# Altium schematic sheet pulsewidth2.SchDoc
size A4; SheetNumber: 2; SheetTotal: 4
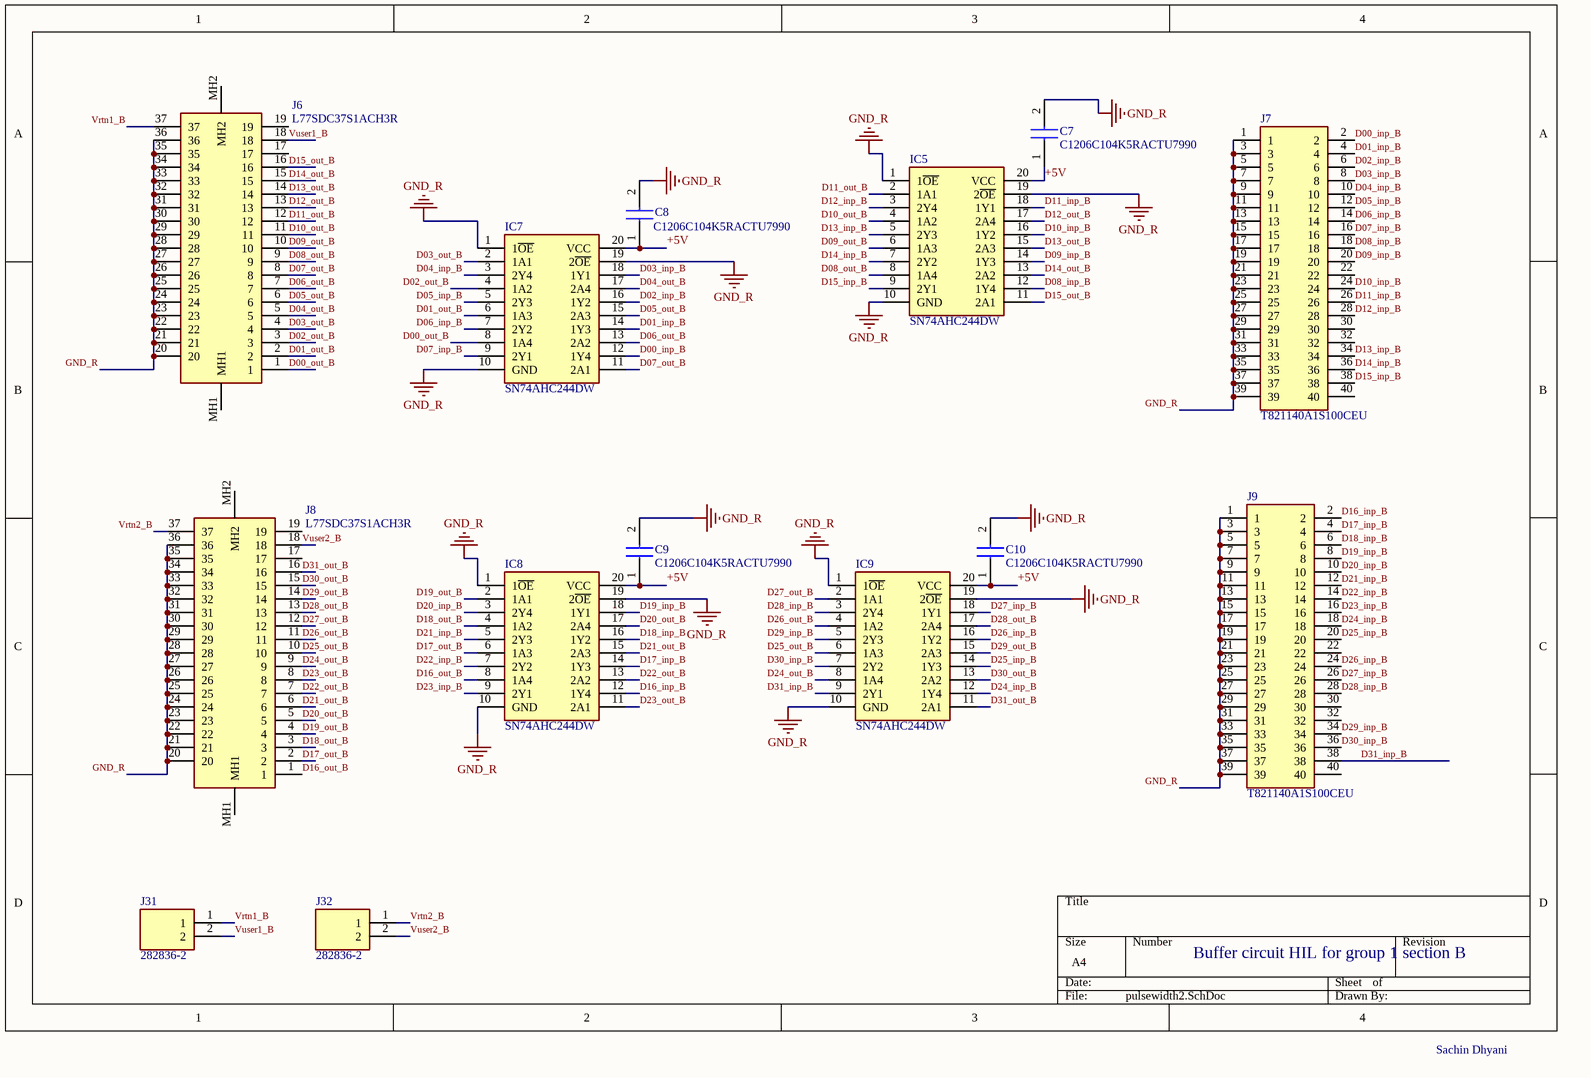
[diagram p0: pulsewidth2.SchDoc]

## Parts
C7  C1206C104K5RACTU7990  [CAPC3216X88N]
C8  C1206C104K5RACTU7990  [CAPC3216X88N]
C9  C1206C104K5RACTU7990  [CAPC3216X88N]
C10  C1206C104K5RACTU7990  [CAPC3216X88N]
IC5  SN74AHC244DW  [SOIC127P1030X265-20N]
IC7  SN74AHC244DW  [SOIC127P1030X265-20N]
IC8  SN74AHC244DW  [SOIC127P1030X265-20N]
IC9  SN74AHC244DW  [SOIC127P1030X265-20N]
J6  L77SDC37S1ACH3R  [L77SDC37S1ACH3R]
J7  T821140A1S100CEU  [SHDR40W64P254X254_2X20_5842X895X915P]
J8  L77SDC37S1ACH3R  [L77SDC37S1ACH3R]
J9  T821140A1S100CEU  [SHDR40W64P254X254_2X20_5842X895X915P]
J31  282836-2  [2828362]
J32  282836-2  [2828362]

## Nets
GND_R: C7.2 C8.2 C9.2 C10.2 IC5.1(1~{OE}) IC5.10(GND) IC5.19(2~{OE}) IC7.1(1~{OE}) IC7.10(GND) IC7.19(2~{OE}) IC8.1(1~{OE}) IC8.10(GND) IC8.19(2~{OE}) IC9.1(1~{OE}) IC9.10(GND) IC9.19(2~{OE}) J6.20 J6.21 J6.22 J6.23 J6.24 J6.25 J6.26 J6.27 J6.28 J6.29 J6.30 J6.31 J6.32 J6.33 J6.34 J6.35 J6.36 J7.1 J7.3 J7.5 J7.7 J7.9 J7.11 J7.13 J7.15 J7.17 J7.19 J7.21 J7.23 J7.25 J7.27 J7.29 J7.31 J7.33 J7.35 J7.37 J7.39 J8.20 J8.21 J8.22 J8.23 J8.24 J8.25 J8.26 J8.27 J8.28 J8.29 J8.30 J8.31 J8.32 J8.33 J8.34 J8.35 J8.36 J9.1 J9.3 J9.5 J9.7 J9.9 J9.11 J9.13 J9.15 J9.17 J9.19 J9.21 J9.23 J9.25 J9.27 J9.29 J9.31 J9.33 J9.35 J9.37 J9.39
+5V: C7.1 C8.1 C9.1 C10.1 IC5.20(VCC) IC7.20(VCC) IC8.20(VCC) IC9.20(VCC)
D00_inp_B: IC7.12(1Y4) J7.2
D00_out_B: IC7.8(1A4) J6.1
D01_inp_B: IC7.14(1Y3) J7.4
D01_out_B: IC7.6(1A3) J6.2
D02_inp_B: IC7.16(1Y2) J7.6
D02_out_B: IC7.4(1A2) J6.3
D03_inp_B: IC7.18(1Y1) J7.8
D03_out_B: IC7.2(1A1) J6.4
D04_inp_B: IC7.3(2Y4) J7.10
D04_out_B: IC7.17(2A4) J6.5
D05_inp_B: IC7.5(2Y3) J7.12
D05_out_B: IC7.15(2A3) J6.6
D06_inp_B: IC7.7(2Y2) J7.14
D06_out_B: IC7.13(2A2) J6.7
D07_inp_B: IC7.9(2Y1) J7.16
D07_out_B: IC7.11(2A1) J6.8
D08_inp_B: IC5.12(1Y4) J7.18
D08_out_B: IC5.8(1A4) J6.9
D09_inp_B: IC5.14(1Y3) J7.20
D09_out_B: IC5.6(1A3) J6.10
D10_inp_B: IC5.16(1Y2) J7.24
D10_out_B: IC5.4(1A2) J6.11
D11_inp_B: IC5.18(1Y1) J7.26
D11_out_B: IC5.2(1A1) J6.12
D12_inp_B: IC5.3(2Y4) J7.28
D12_out_B: IC5.17(2A4) J6.13
D13_inp_B: IC5.5(2Y3) J7.34
D13_out_B: IC5.15(2A3) J6.14
D14_inp_B: IC5.7(2Y2) J7.36
D14_out_B: IC5.13(2A2) J6.15
D15_inp_B: IC5.9(2Y1) J7.38
D15_out_B: IC5.11(2A1) J6.16
D16_inp_B: IC8.12(1Y4) J9.2
D16_out_B: IC8.8(1A4) J8.1
D17_inp_B: IC8.14(1Y3) J9.4
D17_out_B: IC8.6(1A3) J8.2
D18_inp_B: IC8.16(1Y2) J9.6
D18_out_B: IC8.4(1A2) J8.3
D19_inp_B: IC8.18(1Y1) J9.8
D19_out_B: IC8.2(1A1) J8.4
D20_inp_B: IC8.3(2Y4) J9.10
D20_out_B: IC8.17(2A4) J8.5
D21_inp_B: IC8.5(2Y3) J9.12
D21_out_B: IC8.15(2A3) J8.6
D22_inp_B: IC8.7(2Y2) J9.14
D22_out_B: IC8.13(2A2) J8.7
D23_inp_B: IC8.9(2Y1) J9.16
D23_out_B: IC8.11(2A1) J8.8
D24_inp_B: IC9.12(1Y4) J9.18
D24_out_B: IC9.8(1A4) J8.9
D25_inp_B: IC9.14(1Y3) J9.20
D25_out_B: IC9.6(1A3) J8.10
D26_inp_B: IC9.16(1Y2) J9.24
D26_out_B: IC9.4(1A2) J8.11
D27_inp_B: IC9.18(1Y1) J9.26
D27_out_B: IC9.2(1A1) J8.12
D28_inp_B: IC9.3(2Y4) J9.28
D28_out_B: IC9.17(2A4) J8.13
D29_inp_B: IC9.5(2Y3) J9.34
D29_out_B: IC9.15(2A3) J8.14
D30_inp_B: IC9.7(2Y2) J9.36
D30_out_B: IC9.13(2A2) J8.15
D31_inp_B: IC9.9(2Y1) J9.38
D31_out_B: IC9.11(2A1) J8.16
Vrtn1_B: J6.37 J31.1
Vrtn2_B: J8.37 J32.1
Vuser1_B: J6.18 J31.2
Vuser2_B: J8.18 J32.2

Not connected (* = marked no-connect by the designer): J6 17 19 MH1 MH2; J7 22 30 32 40; J8 17 19 MH1 MH2; J9 22 30 32 40

## Notes on the sheet
- Buffer circuit HIL for group 1 section B
- Sachin Dhyani

## Library data of the parts
C7-C10 = C1206C104K5RACTU7990: Capacitor; Manufacturer_Name: KEMET; Datasheet Link: https://api.kemet.com/component-edge/download/specsheet/C1206C104K5RACTU.pdf; Height: 0.88mm; Manufacturer_Part_Number: C1206C104K5RACTU7990; Arrow Part Number: C1206C104K5RACTU7990; Arrow Price/Stock: https://www.arrow.com/en/products/c1206c104k5ractu7990/kemet-corporation?utm_currency=USD&region=nac
IC5 IC7-IC9 = SN74AHC244DW: Integrated Circuit; Manufacturer_Name: Texas Instruments; Datasheet Link: https://datasheet.datasheetarchive.com/originals/distributors/Datasheets-301/18405.pdf; Height: 2.65mm; Manufacturer_Part_Number: SN74AHC244DW; Mouser Part Number: 595-SN74AHC244DW; Mouser Price/Stock: https://www.mouser.co.uk/ProductDetail/Texas-Instruments/SN74AHC244DW?qs=j%2FZo4ajzVJKtLyxm%252BX3lew%3D%3D; Arrow Part Number: SN74AHC244DW; Arrow Price/Stock: https://www.arrow.com/en/products/sn74ahc244dw/texas-instruments?region=nac
J6 J8 = L77SDC37S1ACH3R: Connector; Manufacturer_Name: Amphenol; Datasheet Link: https://cdn.amphenol-cs.com/media/wysiwyg/files/drawing/l77sdxxxs1ach3r.pdf; Height: 12.93mm; Manufacturer_Part_Number: L77SDC37S1ACH3R; Mouser Part Number: 523-L77SDC37S1ACH3R; Mouser Price/Stock: https://www.mouser.co.uk/ProductDetail/Amphenol-Commercial-Products/L77SDC37S1ACH3R?qs=mq7kV%2Fq8lk7HpO2gUh7qRA%3D%3D
J7 J9 = T821140A1S100CEU: Connector; Manufacturer_Name: Amphenol; Datasheet Link: http://www.farnell.com/datasheets/1648843.pdf; Height: 9.15mm; Manufacturer_Part_Number: T821140A1S100CEU; Mouser Part Number: N/A; Mouser Price/Stock: https://www.mouser.co.uk/ProductDetail/Amphenol/T821140A1S100CEU?qs=%252BRAvXJslkuDIVA7vEt1SFA%3D%3D; Arrow Part Number: T821140A1S100CEU; Arrow Price/Stock: https://www.arrow.com/en/products/t821140a1s100ceu/amphenol-fci?region=europe
J31 J32 = 282836-2: Connector; Manufacturer_Name: TE Connectivity; Datasheet Link: https://www.te.com/commerce/DocumentDelivery/DDEController?Action=srchrtrv&DocNm=1-1773458-1_EURO_STYLE_QRG&DocType=Data%20Sheet&DocLang=English&PartCntxt=282836-2&DocFormat=pdf; Height: 10mm; Manufacturer_Part_Number: 282836-2; Mouser Part Number: 571-2828362; Mouser Price/Stock: https://www.mouser.co.uk/ProductDetail/TE-Connectivity/282836-2?qs=A%252Bip%252BNCYi6Ohx9vaQ1l4dg%3D%3D; Arrow Part Number: 282836-2; Arrow Price/Stock: https://www.arrow.com/en/products/282836-2/te-connectivity?utm_currency=USD&region=nac